# Altium schematic sheet MicroSD.SchDoc
size A; SheetNumber: 4; SheetTotal: 6
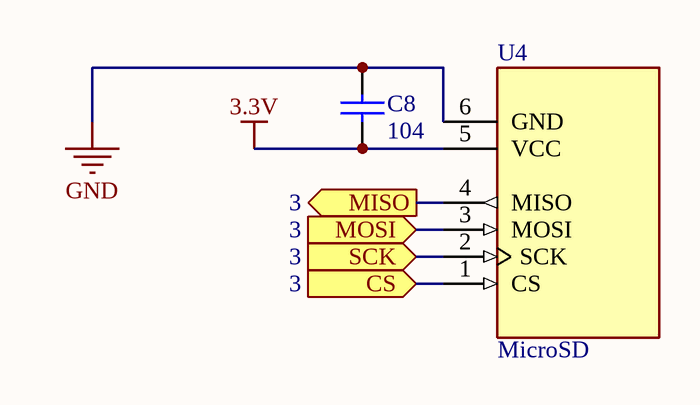
[diagram p0: MicroSD.SchDoc]

## Parts
C8  104  [tu gom]
U4  MicroSD  [MODULE_254]

## Ports
CS (in, see 3), MISO (out, see 3), MOSI (in, see 3), SCK (in, see 3)

## Nets
3.3V: C8.2 U4.5(VCC)
GND: C8.1 U4.6(GND)
CS: U4.1(CS) ; port CS
MISO: U4.4(MISO) ; port MISO
MOSI: U4.3(MOSI) ; port MOSI
SCK: U4.2(SCK) ; port SCK

## Library data of the parts
C8 = Tu gom 104 50V: Cắm; So_Chan: 2; Ten_Linh_Kien: Tụ gốm 104 100nF 50V; Don_Vi: Con; Ma_Hang: MH004761; Chung_Loai: Cắm; Kieu_Chan: *
U4 = 254: MicroSD card breakout board+; MF: Keystone Electronics; Check_prices: https://www.snapeda.com/parts/254/Adafruit+Industries/view-part/?ref=eda; Value: *; Purchase-URL: https://pricing.snapeda.com/search/part/254/?ref=eda; Package: Keystone Electronics; Price: None; MP: 254; Availability: In Stock; SnapEDA_Link: https://www.snapeda.com/parts/254/Adafruit+Industries/view-part/?ref=snap